# EAGLE design ECBoard_v3 (EAGLE 7.7.0)

## Sheet 1 of 2
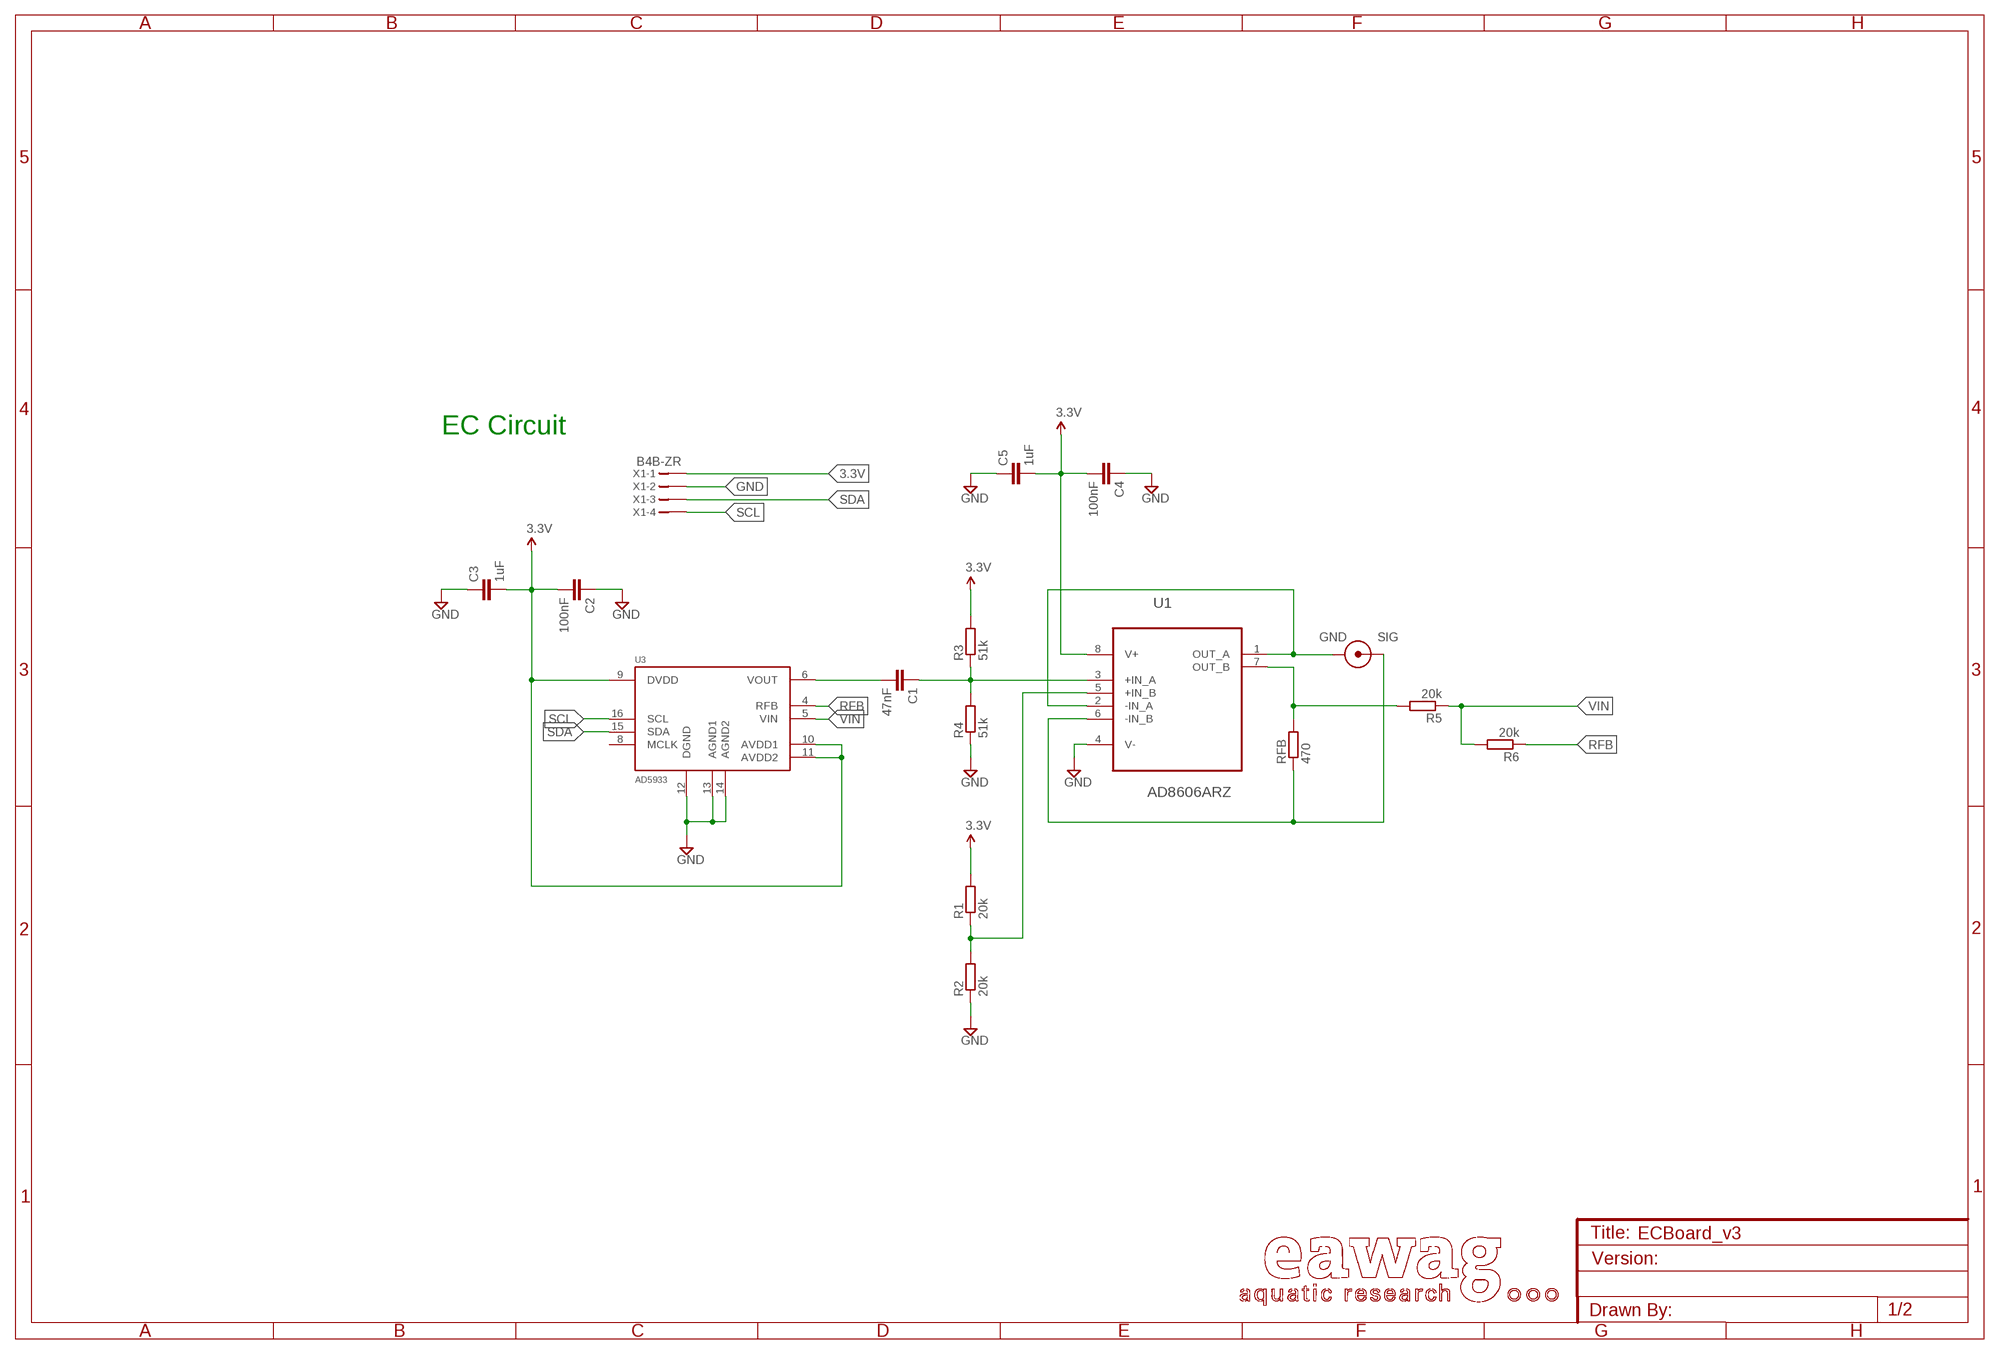
[diagram p0: schematic, sheet 1]

### Parts
C1  47nF  C-EUC0805  [C0805]
C2  100nF  C-EUC0805  [C0805]
C3  1uF  C-EUC0805  [C0805]
C4  100nF  C-EUC0805  [C0805]
C5  1uF  C-EUC0805  [C0805]
R1  20k  R-EU_R0805  [R0805]
R2  20k  R-EU_R0805  [R0805]
R3  51k  R-EU_R0805  [R0805]
R4  51k  R-EU_R0805  [R0805]
R5  20k  R-EU_R0805  [R0805]
R6  20k  R-EU_R0805  [R0805]
RFB  470  R-EU_R0805  [R0805]
U1  AD8606ARZ  [SOIC127P600X175-8N]
U3  AD5933  [SSOP16]
U$1  CON_HANNA  [CON_HANNA]
X1  B4B-ZR  [B4B-ZR]

### Nets
3.3V: C2.2 C3.2 C4.2 C5.2 R1.2 R3.2 U1.8(V+) U3.9(DVDD) U3.10(AVDD1) U3.11(AVDD2) X1.1 ; also sheet 2
GND: C2.1 C3.1 C4.1 C5.1 R2.1 R4.1 U1.4(V-) U3.12(DGND) U3.13(AGND1) U3.14(AGND2) X1.2 ; also sheet 2
N$2: C1.1 R3.1 R4.2 U1.3(+IN_A)
N$3: U1.1(OUT_A) U1.2(-IN_A) U$1.CON_GND
N$4: C1.2 U3.6(VOUT)
N$6: RFB.1 U1.6(-IN_B) U$1.CON_SIG
N$7: R1.1 R2.2 U1.5(+IN_B)
N$8: R5.2 RFB.2 U1.7(OUT_B)
RFB: R6.1 U3.4(RFB)
SCL: U3.16(SCL) X1.4
SDA: U3.15(SDA) X1.3
VIN: R5.1 R6.2 U3.5(VIN)
Unconnected: U3.8(MCLK)

### Notes on the sheet
- EC Circuit

## Sheet 2 of 2
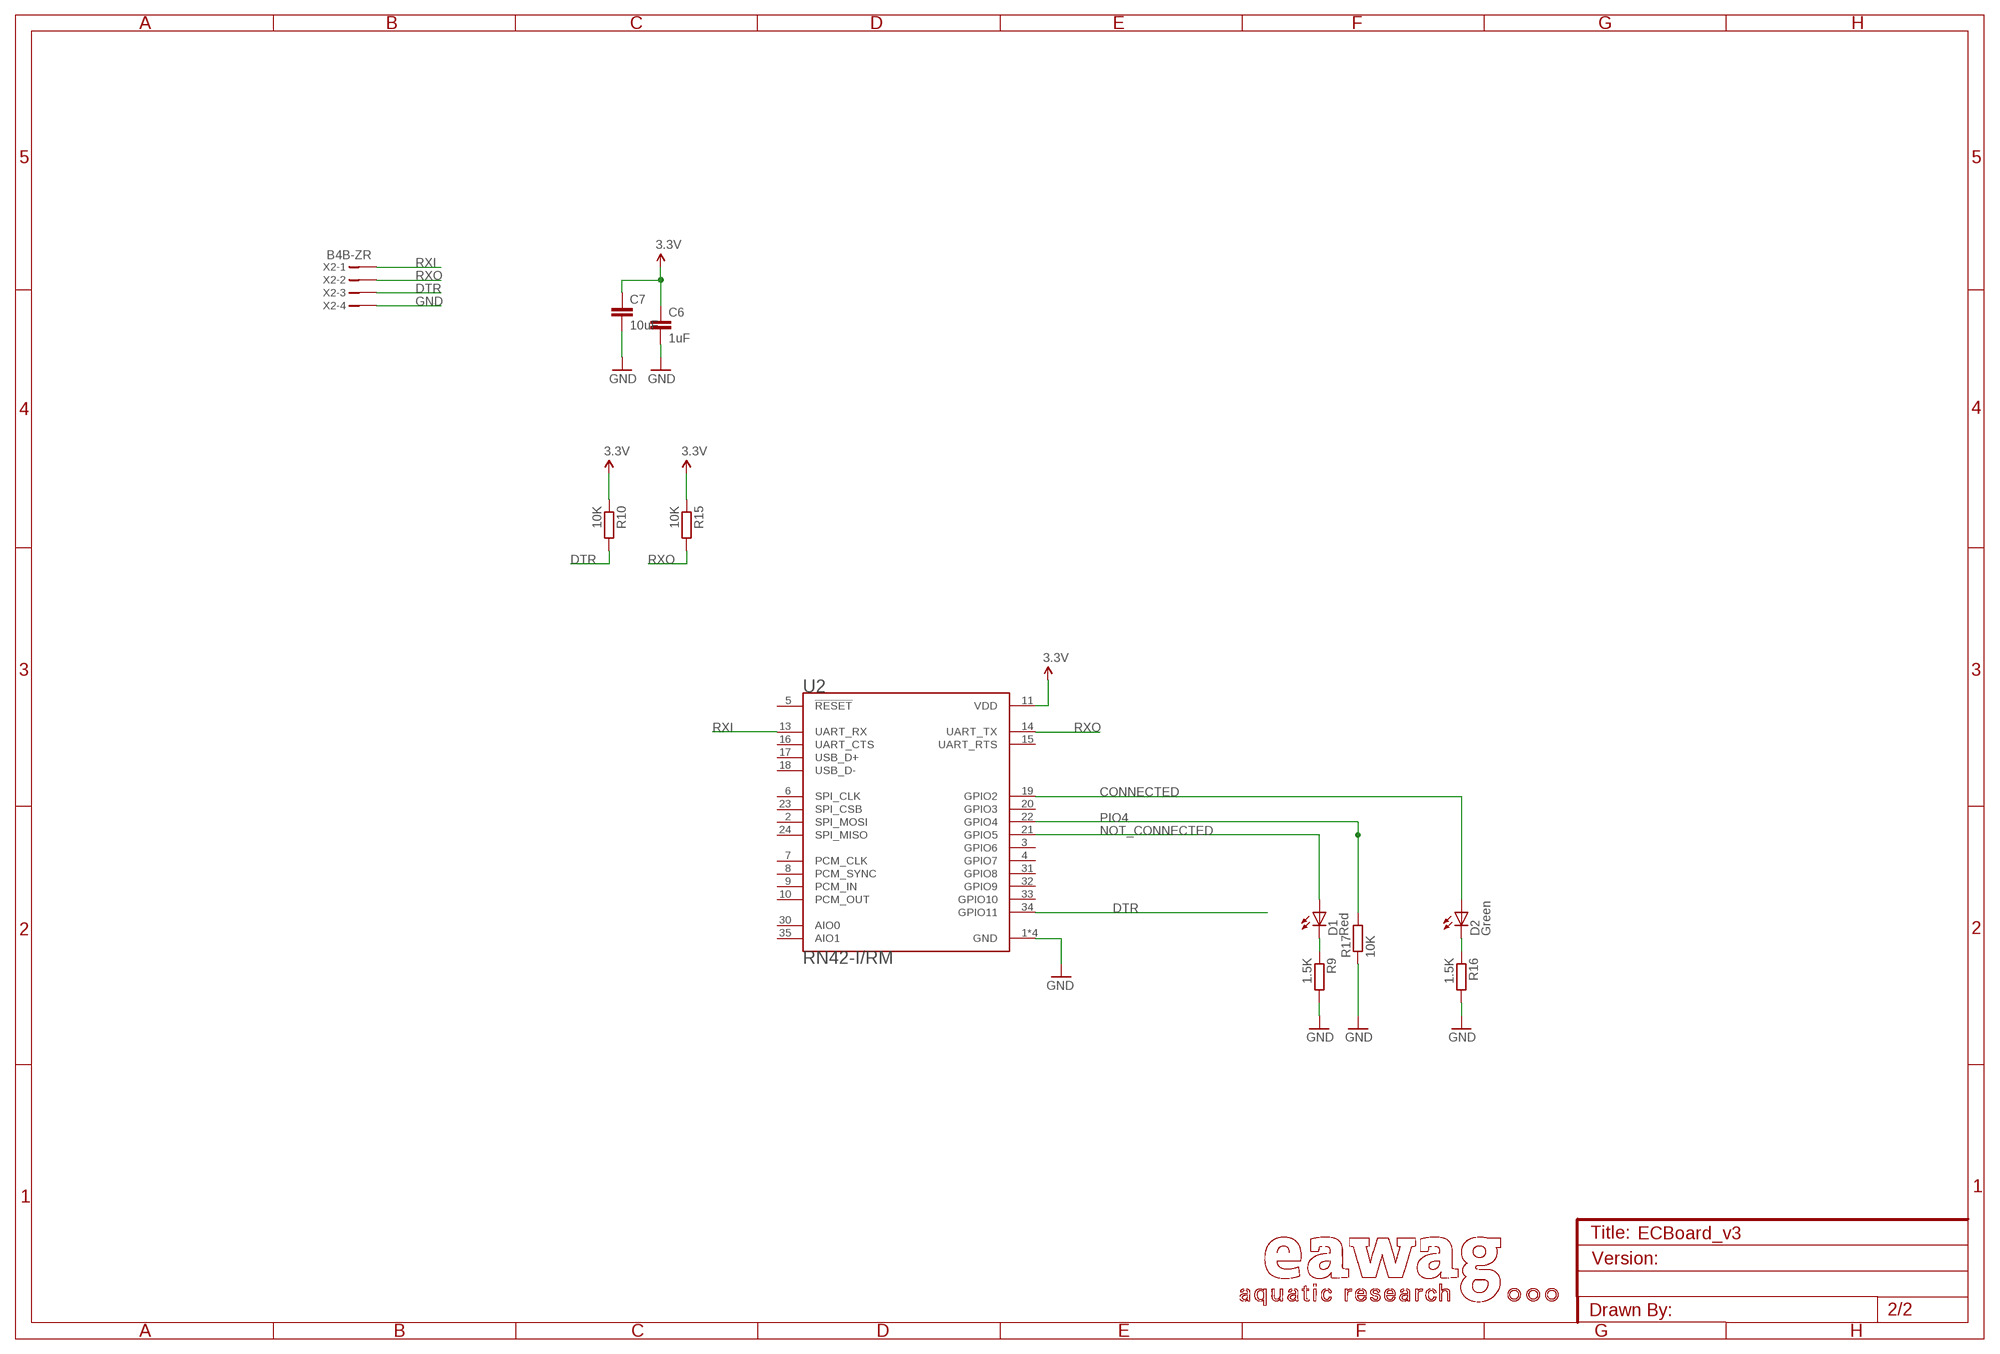
[diagram p1: schematic, sheet 2]

### Parts
C6  1uF  C-EUC0805  [C0805]
C7  10uF  C-EUC0805  [C0805]
D1  Red  LED0603  [LED-0603]
D2  Green  LED0603  [LED-0603]
R9  1.5K  R-EU_R0805  [R0805]
R10  10K  R-EU_R0805  [R0805]
R15  10K  R-EU_R0805  [R0805]
R16  1.5K  R-EU_R0805  [R0805]
R17  10K  R-EU_R0805  [R0805]
U2  RN42-I/RM  [XCVR_RN42-I/RM]
X2  B4B-ZR  [B4B-ZR]

### Nets
3.3V: C6.1 C7.1 R10.1 R15.1 U2.11(VDD) ; also sheet 1
CONNECTED: D2.A U2.19(GPIO2)
D1: D1.C R9.1
D2: D2.C R16.1
DTR: R10.2 U2.34(GPIO11) X2.3
GND: C6.2 C7.2 R9.2 R16.2 R17.1 U2.1(GND) U2.12(GND) U2.28(GND) U2.29(GND) X2.4 ; also sheet 1
NOT_CONNECTED: D1.A U2.21(GPIO5)
PIO4: R17.2 U2.22(GPIO4)
RXI: U2.13(UART_RX) X2.1
RXO: R15.2 U2.14(UART_TX) X2.2
Unconnected: U2.2(SPI_MOSI) U2.3(GPIO6) U2.4(GPIO7) U2.5(!RESET) U2.6(SPI_CLK) U2.7(PCM_CLK) U2.8(PCM_SYNC) U2.9(PCM_IN) U2.10(PCM_OUT) U2.15(UART_RTS) U2.16(UART_CTS) U2.17(USB_D+) U2.18(USB_D-) U2.20(GPIO3) U2.23(SPI_CSB) U2.24(SPI_MISO) U2.30(AIO0) U2.31(GPIO8) U2.32(GPIO9) U2.33(GPIO10) U2.35(AIO1)

## Library data of the parts
C1 C2 C4 = rcl:C-EU: CAPACITOR, European symbol
C3 C5-C7 = 1_RCL-eawag:C-EU: CAPACITOR, European symbol
D1 D2 = SparkFun:LED: LEDs Standard schematic elements and footprints for 5mm, 3mm, 1206, and 0603 sized LEDs. 5mm - Spark Fun Electronics SKU : COM-00529 (and others)
R1-R6 RFB = rcl:R-EU_: RESISTOR, European symbol
R9 R10 R15-R17 = 1_RCL-eawag:R-EU_: RESISTOR, European symbol
U1 = Analog Devices_By_element14_Batch_1:AD8606ARZ: Precision, Low Noise, CMOS, Rail-to-Rail, Input/Output Operational Amplifiers; MPN: AD8606ARZ; OC_FARNELL: 9994343; OC_NEWARK: 19M0974; PACKAGE: SOIC-8; SUPPLIER: Analog Devices
U2 = RN42-I_RM:RN42-I/RM: Bluetooth 2.1 class 2 surface mount module with built in antenna; AVAILABILITY: Unavailable; DESCRIPTION: Bluetooth Module; MF: Microchip; MP: RN42-I/RM; PACKAGE: SMD-35 Roving Networks; PRICE: None
U3 = eawag:AD5933: 1 MSPS, 12-Bit Impedance Converter, Network Analyzer Applications: Electrochemical analysis Bioelectrical impedance analysis Impedance spectroscopy Complex impedance measurement Corrosion monitoring and protection equipment Biomedical and automotive sensors Proximity sensing Nondestructive testing Material property analysis Fuel/battery cell condition monitoring source <http://www.analog.com/static/imported-files/data_sheets/AD5933.pdf>
U$1 = eawag:CON_HANNA
X1 X2 = con-jst:?4B-ZR: ZH CONNECTOR 1.5 mm, 4 pin 1 row Source: http://www.jst.com .. eZH.pdf; MF: FARNELL; MPN: B4B-ZR(LF)(SN); OC_FARNELL: 1830916; OC_NEWARK: 37K9960

## Board
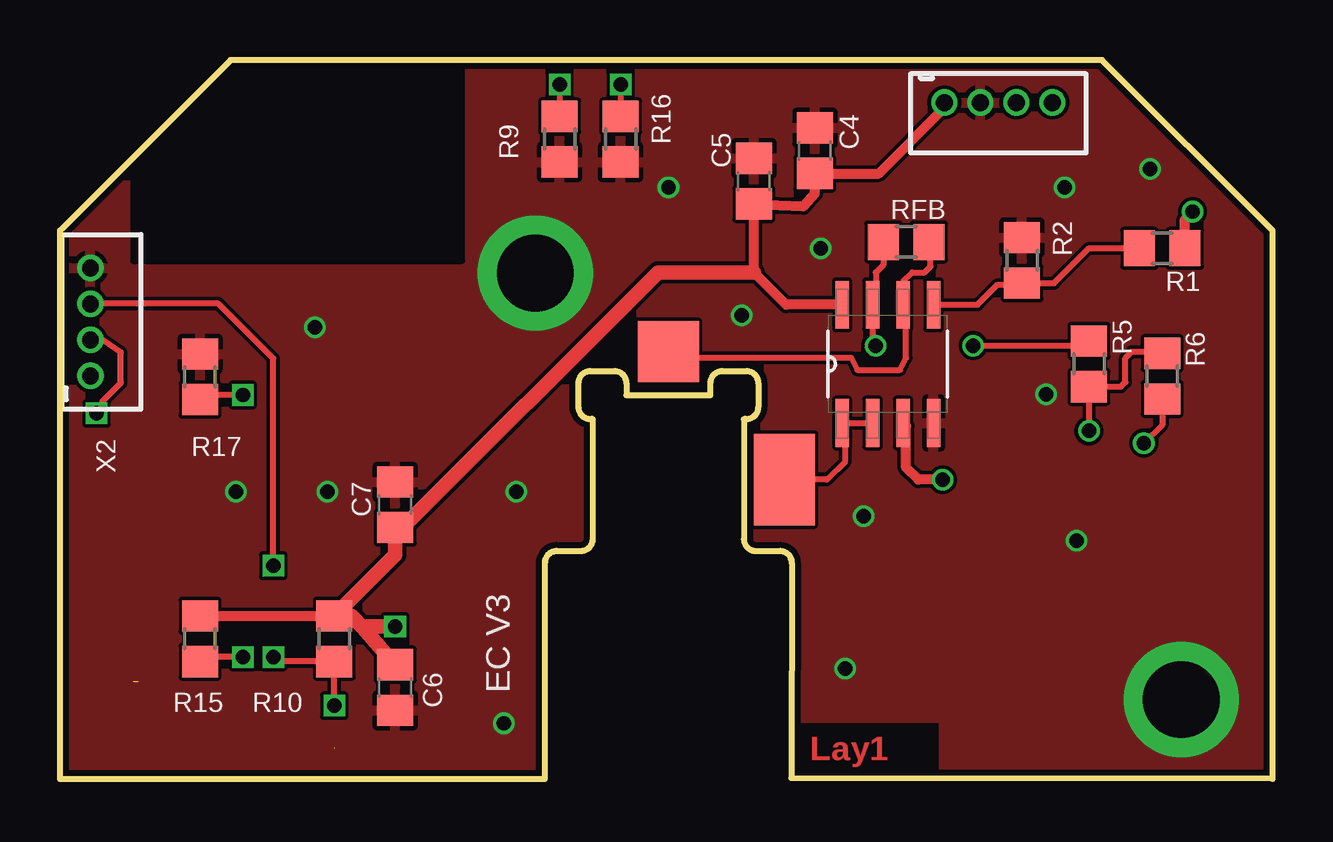
[diagram p2: board, top side]
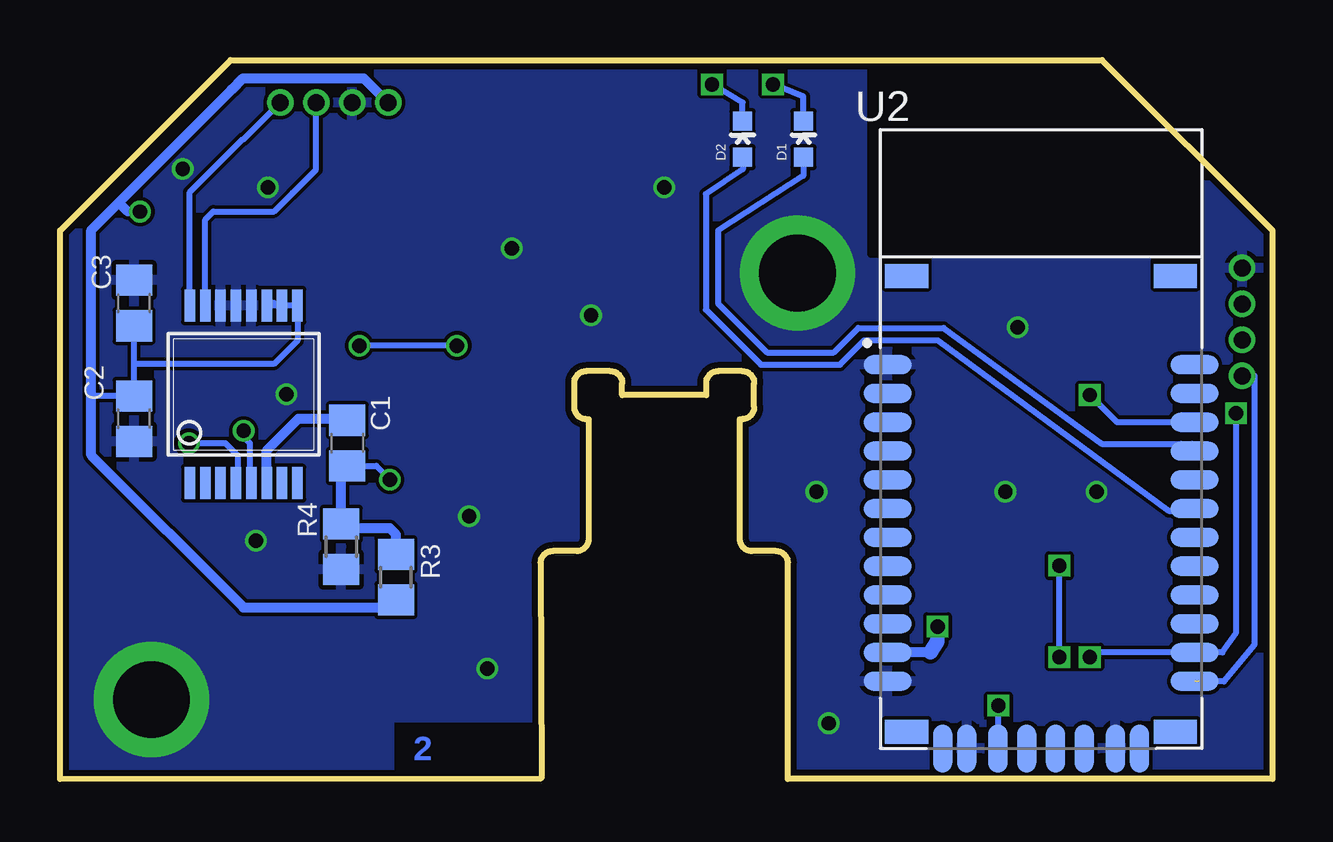
[diagram p3: board, bottom side, seen from below]

Size 50.55 x 29.97 mm. Coordinates in mm from the lower left corner, seen from the top.
Outline: 0,0 20.21,0 20.21,9 arc-90 20.71,9.5 21.71,9.5 arc90 22.21,10 22.21,15 22.11,15 arc-90 21.61,15.5 21.61,16.5 arc-90 22.11,17 23.11,17 arc-90 23.61,16.5 23.61,16 27.11,16 27.11,16.5 arc-90 27.61,17 28.61,17 arc-90 29.11,16.5 29.11,15.5 arc-90 28.61,15 28.51,15 28.51,10 arc90 29.01,9.5 30.01,9.5 arc-90 30.51,9 30.48,0.03 50.55,0 50.55,22.86 43.43,29.97 7.11,29.97 0,22.86 0,0
Copper layers (1*16): Top 0.018mm / dielectric 1.55mm / Bottom 0.018mm
Design rules "eC_2Layer_PClass6_BaseCopperO18_eCDefault": minimum track width 0.15mm, minimum drill 0.35mm, track to track 0.15mm, track to pad 0.15mm, pad to pad 0.15mm, via to via 0.15mm, smd to smd 0mil, copper to edge 0.25mm, drill to drill 0.35mm, minimum pad ring 0.175mm, minimum via ring 0.125mm, stop-mask expansion 0mil, vias tented up to drill 0.45mm, thermal gap 0.2mm
tRestrict: area 3,21.6 to 16.8,30
bRestrict: area 3,21.8 to 16.8,30

### Footprints (pad centres in the part's own frame; a part is rotated, then mirrored left to right if it is on the bottom)
C0805 = smd 1.3 x 1.5: 1 -0.95,0; 2 0.95,0
LED-0603 = smd 0.8 x 0.8: A 0,-0.75; C 0,0.75
R0805 = smd 1.3 x 1.5: 1 -0.95,0; 2 0.95,0
SOIC127P600X175-8N = smd 1.981 x 0.559: 1 -2.464,1.905; 2 -2.464,0.635; 3 -2.464,-0.635; 4 -2.464,-1.905; 5 2.464,-1.905; 6 2.464,-0.635; 7 2.464,0.635; 8 2.464,1.905
XCVR_RN42-I/RM = smd 2 x 0.8: 1 -6.4,6.6; 2 -6.4,5.4; 3 -6.4,4.2; 4 -6.4,3; 5 -6.4,1.8; 6 -6.4,0.6; 7 -6.4,-0.6; 8 -6.4,-1.8; 9 -6.4,-3; 10 -6.4,-4.2; 11 -6.4,-5.4; 12 -6.4,-6.6; 13 6.4,-6.6; 14 6.4,-5.4; 15 6.4,-4.2; 16 6.4,-3; 17 6.4,-1.8; 18 6.4,-0.6; 19 6.4,0.6; 20 6.4,1.8; 21 6.4,3; 22 6.4,4.2; 23 6.4,5.4; 24 6.4,6.6 | smd 0.8 x 2: 28 3.1,-9.4; 29 -3.1,-9.4; 30 4.1,-9.4; 31 1.8,-9.4; 32 0.6,-9.4; 33 -0.6,-9.4; 34 -1.8,-9.4; 35 -4.1,-9.4 | smd 1.8 x 1: S1 -5.6,-8.7; S2 5.6,-8.7; S3 5.6,10.3; S4 -5.6,10.3
SSOP16 = smd 0.44 x 1.34: 1 -2.24,-3.7; 2 -1.6,-3.7; 3 -0.96,-3.7; 4 -0.32,-3.7; 5 0.32,-3.7; 6 0.96,-3.7; 7 1.6,-3.7; 8 2.24,-3.7; 9 2.24,3.7; 10 1.6,3.7; 11 0.96,3.7; 12 0.32,3.7; 13 -0.32,3.7; 14 -0.96,3.7; 15 -1.6,3.7; 16 -2.24,3.7
CON_HANNA = smd 3.81 x 2.54: CON_GND 5.334,4.826 | smd 2.54 x 2.54: CON_SIG 0,0
B4B-ZR = drill 0.7 pad 1.1: 1 -2.25,0; 2 -0.75,0; 3 0.75,0; 4 2.25,0

### Placement (x,y rotation side)
C1  38.57,14 90 bottom
C2  47.46,15.01 90 bottom
C3  47.46,19.84 270 bottom
C4  31.46,26.19 270 top
C5  28.92,24.92 270 top
C6  13.97,3.81 270 top
C7  13.97,11.43 90 top
D1  19.56,26.67 0 bottom
D2  22.1,26.67 0 bottom
R1  45.94,22.13 0 top
R2  40.1,21.62 270 top
R3  36.54,8.41 270 bottom
R4  38.83,9.68 90 bottom
R5  42.89,17.3 90 top
R6  45.94,16.79 90 top
R9  20.83,26.67 270 top
R10  11.43,5.84 270 top
R15  5.84,5.84 270 top
R16  23.37,26.67 270 top
R17  5.84,16.76 270 top
RFB  35.27,22.38 180 top
U1  34.51,17.3 90 top
U2  9.65,10.67 0 bottom
U3  42.89,16.03 0 bottom
U$1  25.36,17.81 270 top
X1  39.12,28.19 0 top
X2  1.27,19.05 90 top

### Tracks (layer width: path | path; a pad name or v marks a point on that pad's centre or on a via)
3.3V  (via drill 0.6)
  Top 0.25: 46.89,23.33 v47.21,23.65
  Top 0.406: U1.8 30.27,19.76 28.92,21.11 C5.2 30.99,23.88 31.46,24.41 C4.2 34.13,25.24 36.83,27.94 36.83,28.16 X1.1 | R1.2 46.89,23.33 | R15.1 R10.1
  Top 0.61: 12.64,6.29 12.15,6.79 R10.1 13.97,9.33 C7.1 13.97,10.16 24.92,21.11 28.92,21.11 | 12.64,6.29 C6.1 | v13.97,6.35 12.7,6.35 12.64,6.29
  Bottom 0.25: 36.86,7.14 R3.2 | 49.24,16.03 49.17,15.96 C2.2 47.46,17.3 | 47.46,17.3 C3.2 | 47.46,17.3 41.62,17.3 40.65,18.27 U3.9 U3.10 | U3.10 41.51,19.73 41.62,19.84 41.82,19.84 U3.11 U3.10
  Bottom 0.254: v47.21,23.65 47.72,23.65
  Bottom 0.406: 48.1,24.03 49.24,22.89 49.24,16.03 49.24,13.49 42.89,7.14 36.86,7.14 | 48.1,24.03 43.4,28.73 43.4,28.74 42.93,29.21 37.88,29.21 X1.1 | 47.72,23.65 48.1,24.03 | 14.27,5.27 U2.11
  Bottom 0.61: 14.27,5.27 13.97,5.73 v13.97,6.35
CONNECTED
  Bottom 0.254: D2.A 22.09,25.41 23.62,24.38 23.62,19.56 21.34,17.27 18.03,17.27 17.02,18.29 13.97,18.29 4.32,11.18 3.16,11.18 | 3.14,11.18 3.16,11.18 | 3.16,11.18 U2.19
D1  (via drill 0.6)
  Top 0.254: v20.83,28.96 R9.1
  Bottom 0.254: D1.C 19.56,28.45 v20.83,28.96
D2  (via drill 0.6)
  Top 0.254: v23.37,28.96 R16.1
  Bottom 0.254: D2.C 22.1,28.19 v23.37,28.96
DTR  (via drill 0.6)  (1 unrouted)
  Top 0.254: v11.43,3.05 R10.2 9.08,4.89 v8.89,5.08 | v8.89,8.89 8.89,17.53 6.6,19.81 1.28,19.81 X2.3
  Bottom 0.254: 11.43,1.27 v11.43,3.05 | v8.89,5.08 v8.89,8.89
GND  (via drill 0.6, 3.2)
  other vias: 32.73,4.6 41.87,24.67 31.71,22.13 25.36,24.67 19.01,11.97 45.43,25.43 41.11,16.03 33.49,10.95 18.51,2.31 42.38,9.93 46.74,3.3 19.81,21.08 7.33,11.97 11.14,11.97 10.63,18.82 28.41,19.33
  pour Top: 50.51,-0.48 50.51,30 16.51,29.97 3.56,30.23 -0.25,30.25 -0.29,22.89 -0.29,-0.48 30.73,-0.25 30.73,2.54 36.83,2.54 36.83,-0.48
  pour Bottom: 50.51,-0.48 50.51,30 16.51,30 0,30.48 0,21.59 -0.29,-0.48 30.73,-0.25 30.73,2.54 36.83,2.54 36.83,-0.48
N$2  (via drill 0.6)
  Top 0.25: 35.27,14.71 U1.3
  Top 0.406: v36.79,12.47 35.78,12.47 35.27,12.98 35.27,14.71
  Bottom 0.25: 38.64,10.44 R4.2 | 38.83,12.79 C1.1 37.37,13.05 v36.79,12.47
  Bottom 0.406: R3.1 36.54,10.19 36.79,10.44 38.64,10.44 | R4.2 38.83,12.79
N$3
  Top 0.25: U1.2 U1.1 32.73,14.71 32.73,13.24 31.97,12.47 U$1.CON_GND
N$4
  Bottom 0.25: 38.64,15.01 C1.2
  Bottom 0.406: U3.6 41.93,13.69 40.6,15.01 38.64,15.01
N$6
  Top 0.25: RFB.1 36.29,22.31 36.29,21.36 36.03,21.11 35.52,21.11 35.14,20.73 U1.6 35.27,19.64 35.27,17.55 35.02,17.05 33.24,17.05 32.98,17.55 25.62,17.55 U$1.CON_SIG
N$7
  Top 0.25: U1.5 38.24,19.76 39.08,20.6 40.03,20.6 R2.2 41.43,20.67 42.89,22.13 R1.1
N$8  (via drill 0.6)
  Top 0.25: v34,18.06 33.87,18.19 U1.7 34,19.89 34,21.11 34.32,21.43 RFB.2 | v38.06,18.06 42.7,18.06 R5.2
  Bottom 0.25: v34,18.06 v38.06,18.06
NOT_CONNECTED
  Bottom 0.254: D1.A 19.56,25.15 23.11,22.86 23.11,19.81 21.08,17.78 18.29,17.78 17.27,18.8 13.72,18.8 7.11,13.97 3.81,13.97 | 3.81,13.97 3.35,13.97 | U2.21 3.51,13.67 3.81,13.97
PIO4  (via drill 0.6)
  Top 0.254: v7.62,16 6.03,16 R17.2
  Bottom 0.254: v7.62,16 6.49,14.87 U2.22
RFB  (via drill 0.6)
  Top 0.25: R6.1 45.94,14.76 v45.18,14
  Bottom 0.25: v45.18,14 43.65,14 43.14,13.49 43.14,12.4 U3.4
RXI  (1 unrouted)
  Bottom 0.254: X2.1 0.76,16.8 0.76,5.59 2.03,4.06 3.05,4.06
RXO  (via drill 0.6)
  Top 0.254: v7.62,5.08 6.03,5.08 R15.2 | v1.52,15.24 1.78,15.75 2.54,16.51 2.54,17.78 1.78,18.29 1.28,18.29 X2.2
  Bottom 0.254: v1.52,15.24 1.52,6.1 2.1,5.27 U2.14 7.43,5.27 v7.62,5.08
SCL
  Bottom 0.25: U3.16 45.13,24.46
  Bottom 0.254: 45.13,24.46 42.93,26.66 42.9,26.66 X1.4
SDA
  Bottom 0.25: U3.15 44.49,23.32 44.16,23.65 41.62,23.65 40.86,24.41
  Bottom 0.254: 40.86,24.41 40.86,24.42 39.88,25.4 X1.3
VIN  (via drill 0.6)
  Top 0.25: R6.2 45.87,17.81 44.67,17.81 44.41,17.55 44.41,16.54 44.23,16.35 R5.1 v42.89,14.51
  Bottom 0.25: v42.89,14.51 42.89,14.25 42.64,14 42.64,12.4 U3.5

### Text on the board
Top: Lay1
Bottom: 2
tNames: EC V3